# EAGLE design Pulse generator (EAGLE 9.6.2)
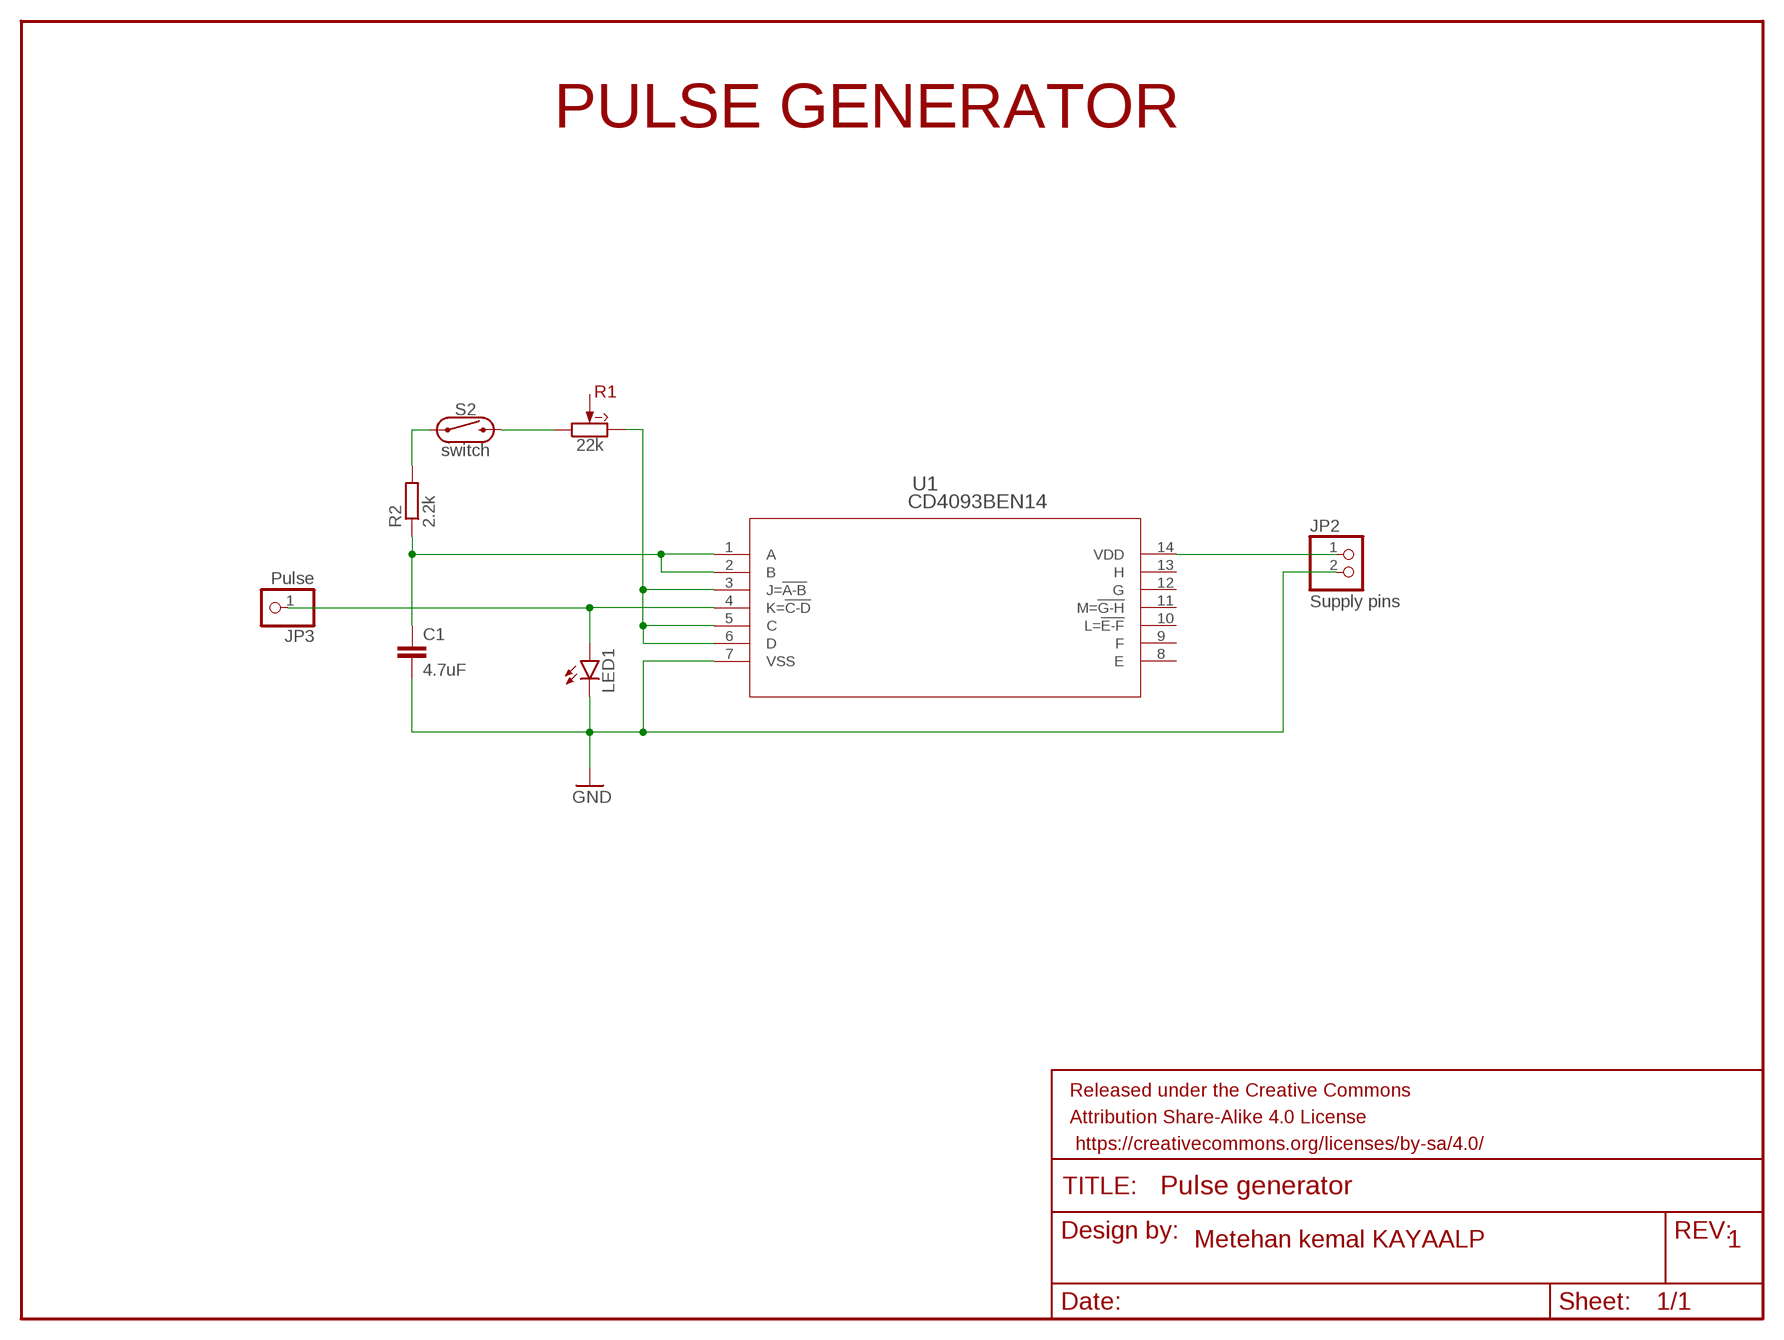
[diagram p0: schematic, sheet 1]

## Parts
C1  4.7uF  C2,5-3  [C2.5-3]
FRAME1  FRAME-LETTER  [CREATIVE_COMMONS]
JP2  Supply pins  PINHD-1X2  [1X02]
JP3  Pulse  PINHD-1X1  [1X01]
LED1  LED5MM  [LED5MM]
R1  22k  A1M(PTD90)  [PTD901]
R2  2.2k  R-EU_0204/2V  [0204V]
S2  switch  REED_SWITCH-PTH-INSULATED  [REED_SWITCH_PLASTIC]
U1  CD4093BEN14  [N14]

## Nets
GND: C1.2 JP2.2 LED1.K(C) U1.7(VSS)
N$1: JP2.1 U1.14(VDD)
N$3: C1.1 R2.1 U1.1(A) U1.2(B)
N$4: R1.3(CW) U1.3(J=!A-B) U1.5(C) U1.6(D)
N$5: R2.2 S2.P$1
N$6: R1.1(CCW) S2.P$2
N$7: JP3.1 LED1.A U1.4(K=!C-D)
Unconnected: R1.2(W) U1.8(E) U1.9(F) U1.10(L=!E-F) U1.11(M=!G-H) U1.12(G) U1.13(H)

## Notes on the sheet
- PULSE GENERATOR
- Metehan kemal KAYAALP | 1

## Library data of the parts
C1 = capacitor-wima:C: CAPACITOR naming: grid - package width
FRAME1 = SparkFun-Aesthetics:FRAME-LETTER: Schematic Frame - Letter Standard 8.5x11 US Letter frame
JP2 = pinhead:PINHD-1X2: PIN HEADER
JP3 = pinhead:PINHD-1X1: PIN HEADER
LED1 = led:LED: LED OSRAM: - CHIPLED LG R971, LG N971, LY N971, LG Q971, LY Q971, LO R971, LY R971 LH N974, LH R974 LS Q976, LO Q976, LY Q976 LO Q996 - Hyper CHIPLED LW Q18S LB Q993, LB Q99A, LB R99A - SideLED LS A670, LO A670, LY A670, LG A670, LP A670 LB A673, LV A673, LT A673, LW A673 LH A674 LY A675 LS A676, LA A676, LO A676, LY A676, LW A676 LS A679, LY A679, LG A679 - Hyper Micro SIDELED® LS Y876, LA Y876, LO Y876, LY Y876 LT Y87S - SmartLED LW L88C, LW L88S LB L89C, LB L89S, LG L890 LS L89K, LO L89K, LY L89K LS L896, LA L896, LO L896, LY L896 - TOPLED LS T670, LO T670, LY T670, LG T670, LP T670 LSG T670, LSP T670, LSY T670, LOP T670, LYG T670 LG T671, LOG T671, LSG T671 LB T673, LV T673, LT T673, LW T673 LH T674 LS T676, LA T676, LO T676, LY T676, LB T676, LH T676, LSB T676, LW T676 LB T67C, LV T67C, LT T67C, LS T67K, LO T67K, LY T67K, LW E67C LS E67B, LA E67B, LO E67B, LY E67B, LB E67C, LV E67C, LT E67C LW T67C LS T679, LY T679, LG T679 LS T770, LO T770, LY T770, LG T770, LP T770 LB T773, LV T773, LT T773, LW T773 LH T774 LS E675, LA E675, LY E675, LS T675 LS T776, LA T776, LO T776, LY T776, LB T776 LHGB T686 LT T68C, LB T68C - Hyper Mini TOPLED® LB M676 - Mini TOPLED Santana® LG M470 LS M47K, LO M47K, LY M47K Source: http://www.osram.convergy.de LUXEON: - LUMILED® LXK2-PW12-R00, LXK2-PW12-S00, LXK2-PW14-U00, LXK2-PW14-V00 LXK2-PM12-R00, LXK2-PM12-S00, LXK2-PM14-U00 LXK2-PE12-Q00, LXK2-PE12-R00, LXK2-PE12-S00, LXK2-PE14-T00, LXK2-PE14-U00 LXK2-PB12-K00, LXK2-PB12-L00, LXK2-PB12-M00, LXK2-PB14-N00, LXK2-PB14-P00, LXK2-PB14-Q00 LXK2-PR12-L00, LXK2-PR12-M00, LXK2-PR14-Q00, LXK2-PR14-R00 LXK2-PD12-Q00, LXK2-PD12-R00, LXK2-PD12-S00 LXK2-PH12-R00, LXK2-PH12-S00 LXK2-PL12-P00, LXK2-PL12-Q00, LXK2-PL12-R00 Source: www.luxeon.com KINGBRIGHT: KA-3528ASYC Source: www.kingbright.com
R1 = potentiometers:?(PTD90)
R2 = rcl:R-EU_: RESISTOR, European symbol; SPICEPREFIX: R
S2 = SparkFun-Switches:REED_SWITCH: Reed Switch A reed switch is a magnetically-actuated switch. When the device is exposed to a magnetic field, the two ferrous materials inside the switch pull together and the switch closes. Variant Overview PTH-GLASS Reed Switch <https://www.sparkfun.com/products/8642> (COM-08642) - PTH reed switch w/ glass body (6.0 x 0.9 mm) PTH-INSULATED Reed Switch - Insulated <https://www.sparkfun.com/products/10601> (COM-10601) - PTH reed switch w/ insulated body (15.1 x 4.2 mm); PROD_ID: SWCH-10467; SF_SKU: COM-10601
U1 = 2023-08-30_09-53-09_Library:CD4093BE; COPYRIGHT: Copyright (C) 2023 Ultra Librarian. All rights reserved.; MANUFACTURER_PART_NUMBER: CD4093BE; MFR_NAME: Texas Instruments

## Board
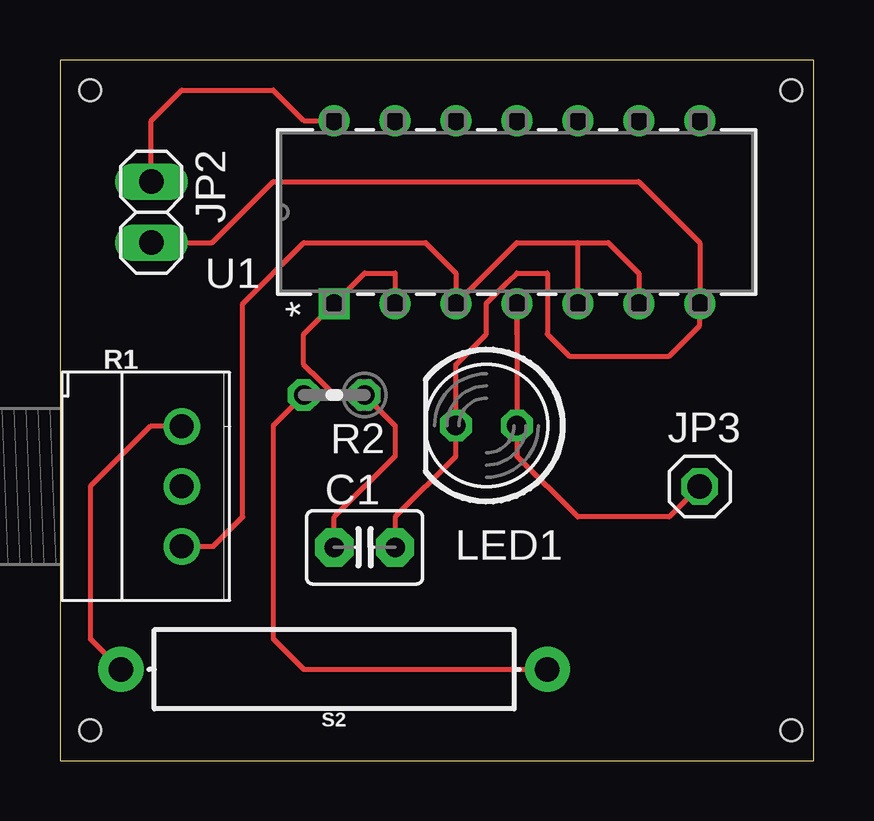
[diagram p1: board, top side]

Size 31.42 x 29.2 mm. Coordinates in mm from the lower left corner, seen from the top.
Outline: 0,0 31.42,0 31.42,29.2 0,29.2 0,0
Copper layers (1*16): Top 0.035mm / dielectric 1.5mm / Bottom 0.035mm
Design rules "default": minimum track width 6mil, minimum drill 0.35mm, track to track 6mil, track to pad 6mil, pad to pad 6mil, via to via 6mil, smd to smd 6mil, copper to edge 40mil, drill to drill 6mil, minimum pad ring 10mil, minimum via ring 8mil, stop-mask expansion 4mil, vias tented up to drill 0mil, thermal gap 10mil
Holes 0.9 mm at 1.27,27.94 1.27,1.27 30.48,27.94 30.48,1.27

### Footprints (pad centres in the part's own frame; a part is rotated, then mirrored left to right if it is on the bottom)
C2.5-3 = drill 0.813 pad 1.6 octagon: 1 -1.27,0; 2 1.27,0
1X02 = drill 1.016 long: 1 -1.27,0; 2 1.27,0
1X01 = drill 1.016 octagon: 1 0,0
LED5MM = drill 0.813 octagon: A -1.27,0; K 1.27,0
PTD901 = drill 1: 1 -2.5,5.08; 2 0,5.08; 3 2.5,5.08
0204V = drill 0.813 octagon: 1 -1.27,0; 2 1.27,0
REED_SWITCH_PLASTIC = drill 1.016 pad 1.88: P$1 -8.89,0; P$2 8.89,0
N14 = drill 0.787 pad 1.295 square: 1 0,0 | drill 0.787 pad 1.295: 2 0,-2.54; 3 0,-5.08; 4 0,-7.62; 5 0,-10.16; 6 0,-12.7; 7 0,-15.24; 8 7.62,-15.24; 9 7.62,-12.7; 10 7.62,-10.16; 11 7.62,-7.62; 12 7.62,-5.08; 13 7.62,-2.54; 14 7.62,0

### Placement (x,y rotation side)
C1  12.7,8.89 0 top
FRAME1  -80.01,-11.43 0 top  (outside the outline)
JP2  3.81,22.86 270 top
JP3  26.67,11.43 0 top
LED1  17.78,13.97 180 top
R1  0,11.43 270 top
R2  11.43,15.24 180 top
S2  11.43,3.81 180 top
U1  11.43,19.05 90 top

### Tracks (layer width: path | path; a pad name or v marks a point on that pad's centre or on a via)
GND
  Top 0.203: JP2.2 6.35,21.59 8.89,24.13 24.13,24.13 26.67,21.59 U1.7 26.67,18.14 25.4,16.87 21.23,16.87 20.32,17.78 20.32,20.32 19.05,20.32 18.68,19.95 17.78,19.06 17.78,17.78 16.51,16.51 LED1.K 16.51,12.7 13.97,10.16 C1.2
N$1
  Top 0.203: JP2.1 3.81,26.67 5.08,27.94 8.89,27.94 10.16,26.67 U1.14
N$3
  Top 0.203: U1.2 13.97,20.32 12.7,20.32 U1.1 10.16,17.78 10.16,16.51 10.52,16.15 10.54,16.15 11.45,15.24 R2.1 13.97,13.97 13.97,12.7 11.43,10.16 C1.1
N$4
  Top 0.203: U1.6 24.13,20.32 22.86,21.59 21.59,21.59 | 21.59,21.59 19.05,21.59 U1.3 16.51,20.32 15.24,21.59 10.16,21.59 7.62,19.05 7.62,10.16 6.39,8.93 R1.3 | U1.5 21.59,21.59
N$5
  Top 0.203: R2.2 8.89,13.97 8.89,5.08 10.16,3.81 S2.P$1
N$6
  Top 0.203: S2.P$2 1.27,5.08 1.27,11.43 3.77,13.93 R1.1
N$7
  Top 0.203: 19.05,17.78 U1.4 LED1.A 19.05,12.7 21.59,10.16 25.4,10.16 JP3.1